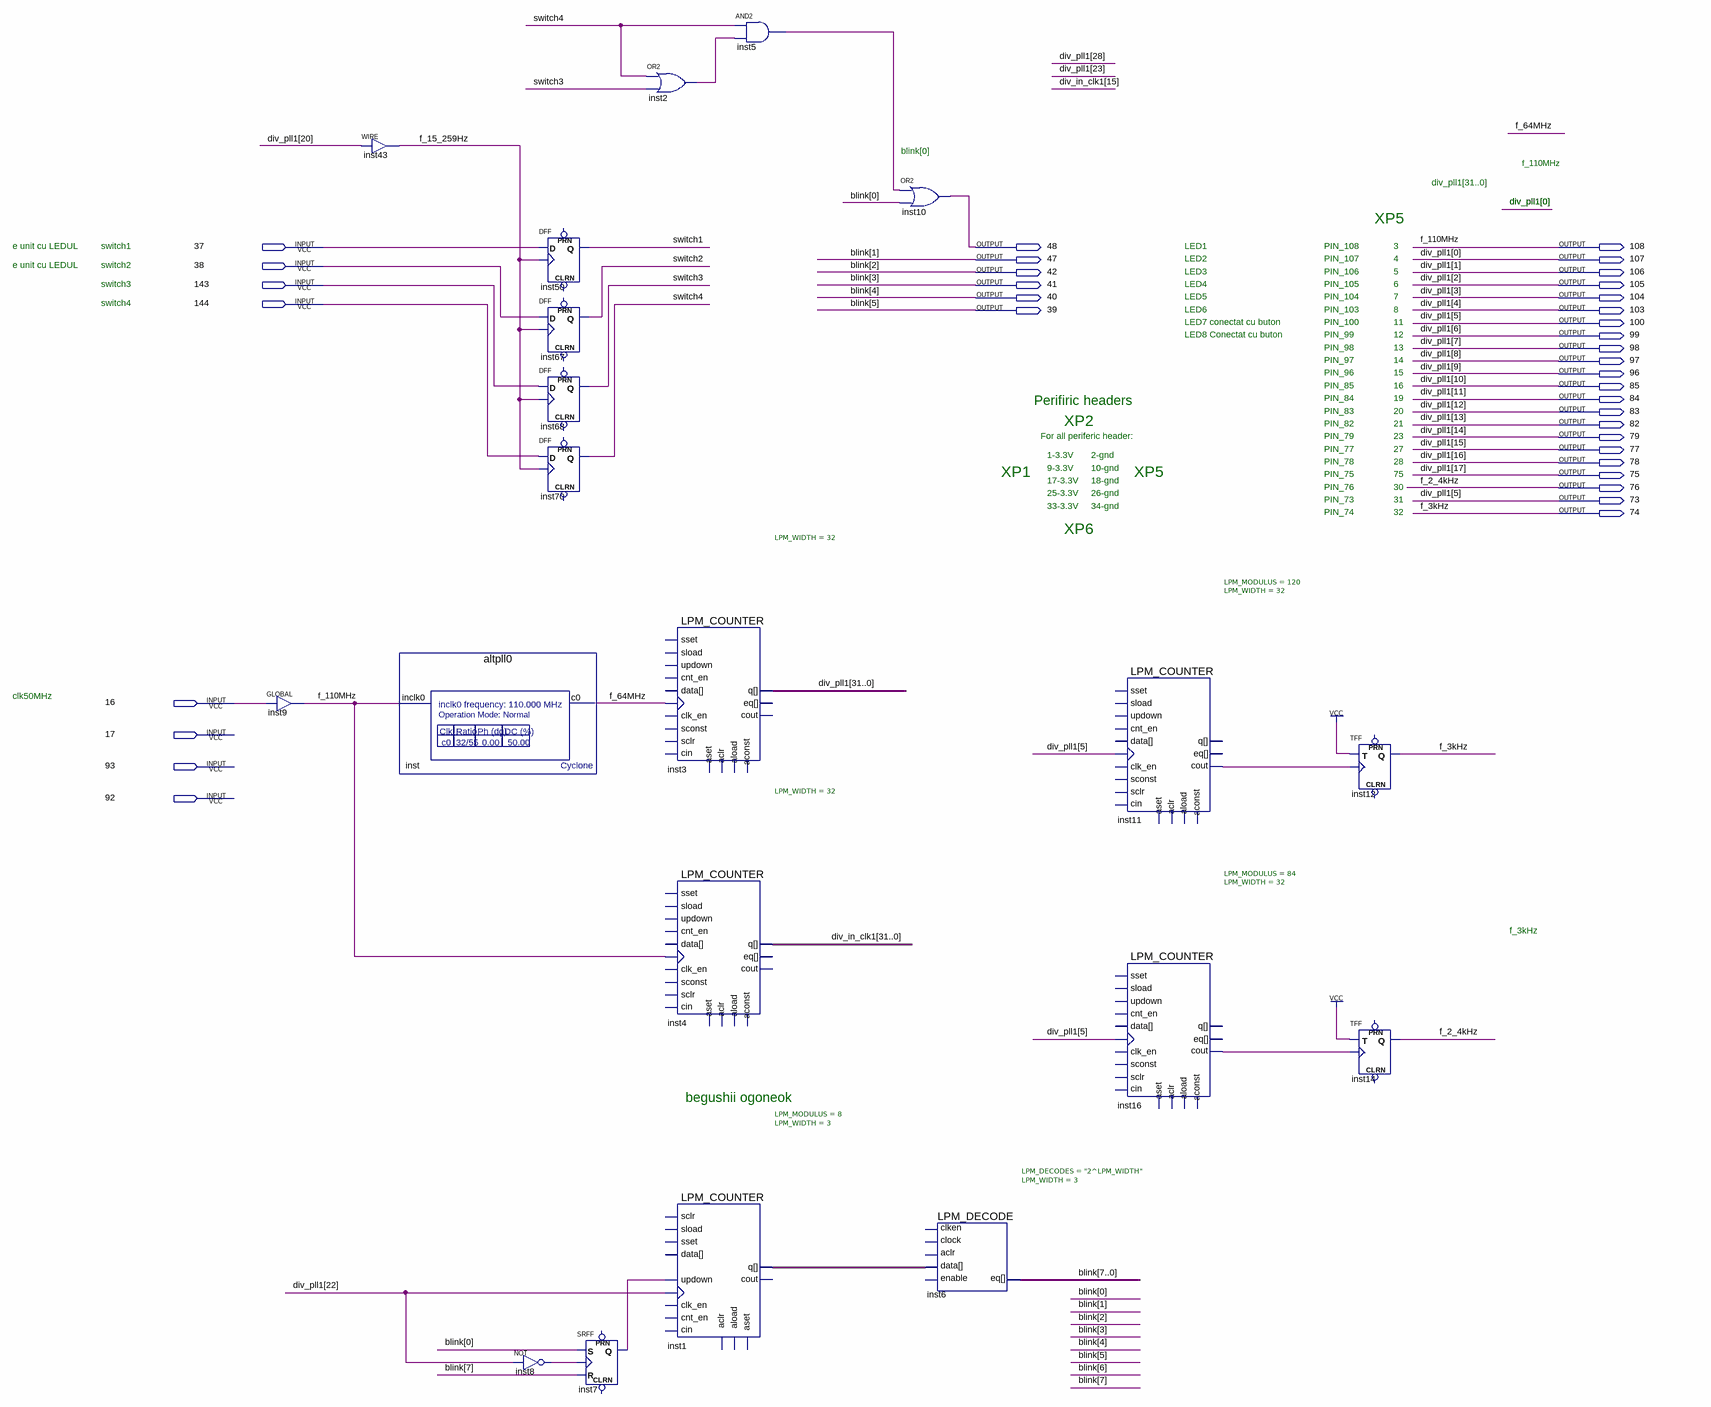
[diagram p0: schematic sheet]
// Quartus schematic Qua_BRD_EP1C6T144I7.bdf as structural Verilog: 20 symbols, 36 pins
module Qua_BRD_EP1C6T144I7 (
  input  \37 ,
  input  \38 ,
  input  \143 ,
  input  \144 ,
  input  \16 ,
  input  \17 ,
  input  \93 ,
  input  \92 ,
  output \48 ,
  output \108 ,
  output \47 ,
  output \107 ,
  output \42 ,
  output \106 ,
  output \41 ,
  output \105 ,
  output \40 ,
  output \104 ,
  output \39 ,
  output \103 ,
  output \100 ,
  output \99 ,
  output \98 ,
  output \97 ,
  output \96 ,
  output \85 ,
  output \84 ,
  output \83 ,
  output \82 ,
  output \79 ,
  output \77 ,
  output \78 ,
  output \75 ,
  output \76 ,
  output \73 ,
  output \74 
);

  wire f_15_259Hz, f_64MHz, inst2_out, inst5_out, inst7_q, inst8_out, inst11_cout, inst16_cout, switch1,
       switch2, switch3, switch4;
  wire [2:0] inst1_q;
  wire [7:0] blink;
  wire [31:0] div_in_clk1;
  wire [31:18] div_pll1;

  GLOBAL inst9 (.IN(\16 ), .OUT(\108 ));
  assign f_15_259Hz = div_pll1[20];  // WIRE inst43
  altpll0 inst (.inclk0(\108 ), .c0(f_64MHz));
  DFF inst50 (.CLK(f_15_259Hz), .D(\37 ), .Q(switch1));  // open: CLRN, PRN
  DFF inst67 (.CLK(f_15_259Hz), .D(\38 ), .Q(switch2));  // open: CLRN, PRN
  DFF inst68 (.CLK(f_15_259Hz), .D(\143 ), .Q(switch3));  // open: CLRN, PRN
  DFF inst70 (.CLK(f_15_259Hz), .D(\144 ), .Q(switch4));  // open: CLRN, PRN
  not inst8 (inst8_out, div_pll1[22]);
  SRFF inst7 (.S(blink[0]), .R(blink[7]), .CLK(inst8_out), .Q(inst7_q));  // open: PRN, CLRN
  or inst2 (inst2_out, switch4, switch3);
  LPM_COUNTER #(.LPM_WIDTH(32)) inst3 (
    .clock(f_64MHz),
    .q({div_pll1, \75 , \78 , \77 , \79 , \82 , \83 , \84 , \85 , \96 , \97 , \98 , \99 , \73 , \103 , \104 , \105 , \106 , \107 }));  // open: sset, sload, updown, cnt_en, data, clk_en, sconst, sclr, aload, aclr, aset, aconst, cin, eq, cout
  LPM_COUNTER #(.LPM_WIDTH(32)) inst4 (
    .clock(\108 ), .q(div_in_clk1));  // open: sset, sload, updown, cnt_en, data, clk_en, sconst, sclr, aload, aclr, aset, aconst, cin, eq, cout
  LPM_COUNTER #(.LPM_MODULUS(8), .LPM_WIDTH(3)) inst1 (
    .clock(div_pll1[22]), .updown(inst7_q), .q(inst1_q));  // open: sload, data, clk_en, aload, aclr, aset, cin, sset, cnt_en, sclr, cout
  and inst5 (inst5_out, switch4, inst2_out);
  or inst10 (\48 , inst5_out, blink[0]);
  LPM_DECODE #(.LPM_DECODES("2^LPM_WIDTH"), .LPM_WIDTH(3)) inst6 (
    .data(inst1_q), .eq({blink[7:6], \39 , \40 , \41 , \42 , \47 , blink[0]}));  // open: enable, clken, clock, aclr
  LPM_COUNTER #(.LPM_MODULUS(120), .LPM_WIDTH(32)) inst11 (
    .clock(\73 ), .cout(inst11_cout));  // open: sset, sload, updown, cnt_en, data, clk_en, sconst, sclr, aload, aclr, aset, aconst, cin, q, eq
  LPM_COUNTER #(.LPM_MODULUS(84), .LPM_WIDTH(32)) inst16 (
    .clock(\73 ), .cout(inst16_cout));  // open: sset, sload, updown, cnt_en, data, clk_en, sconst, sclr, aload, aclr, aset, aconst, cin, q, eq
  TFF inst12 (.T(1'b1), .CLK(inst11_cout), .Q(\74 ));  // open: PRN, CLRN
  TFF inst14 (.T(1'b1), .CLK(inst16_cout), .Q(\76 ));  // open: PRN, CLRN

  assign \100  = \73 ;

  // Other names for the same wires on the sheet: blink[5:1] = {\39 , \40 , \41 , \42 , \47 };
  //   div_pll1[17:0] = {\75 , \78 , \77 , \79 , \82 , \83 , \84 , \85 , \96 , \97 , \98 , \99 , \73 , \103 , \104 , \105 , \106 , \107 };
  //   f_2_4kHz = \76 ; f_3kHz = \74 ; f_110MHz = \108 

  // Notes on the sheet:
  //   blink[0]
  //   f_110MHz
  //   div_pll1[31..0]
  //   div_pll1[0]
  //   XP5
  //   e unit cu LEDUL
  //   switch1
  //   LED1
  //   PIN_108
  //   3
  //   LED2
  //   PIN_107
  //   4
  //   e unit cu LEDUL
  //   switch2
  //   LED3
  //   PIN_106
  //   5
  //   switch3
  //   LED4
  //   PIN_105
  //   6
  //   LED5
  //   PIN_104
  //   7
  //   switch4
  //   LED6
  //   PIN_103
  //   8
  //   LED7 conectat cu buton
  //   PIN_100
  //   11
  //   LED8 Conectat cu buton
  //   PIN_99
  //   12
  //   PIN_98
  //   13
  //   PIN_97
  //   14
  //   PIN_96
  //   15
  //   PIN_85
  //   16
  //   Perifiric headers
  //   PIN_84
  //   19
  //   PIN_83
  //   20
  //   XP2
  //   PIN_82
  //   21
  //   For all periferic header:
  //   PIN_79
  //   23
  //   PIN_77
  //   27
  //   1-3.3V
  //   2-gnd
  //   PIN_78
  //   28
  //   XP1
  //   9-3.3V
  //   10-gnd
  //   XP5
  //   PIN_75
  //   75
  //   17-3.3V
  //   18-gnd
  //   PIN_76
  //   30
  //   25-3.3V
  //   26-gnd
  //   PIN_73
  //   31
  //   33-3.3V
  //   34-gnd
  //   PIN_74
  //   32
  //   XP6
  //   clk50MHz
  //   f_3kHz
  //   begushii ogoneok
endmodule
